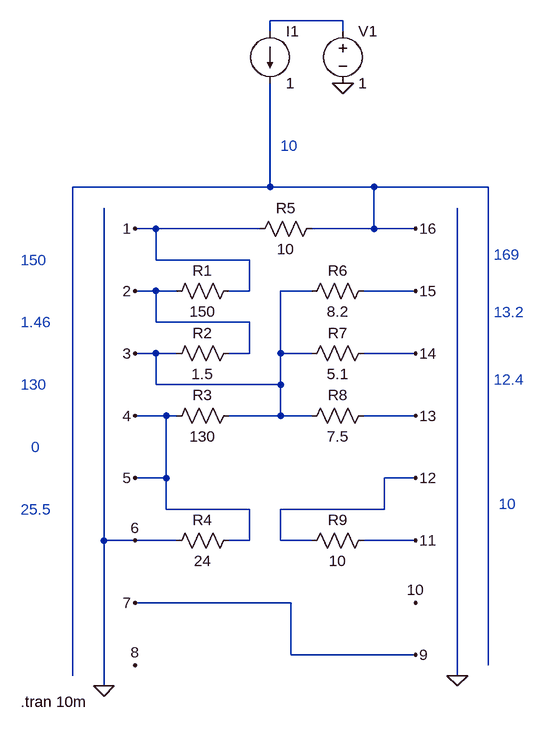
[diagram p0: schematic NetRes 16055376.asc]
NetRes 16055376.asc, the LTspice schematic file:
Version 4
SHEET 1 880 792
WIRE 288 -272 176 -272
WIRE 176 -256 176 -272
WIRE 288 -256 288 -272
WIRE 176 -16 176 -176
WIRE 176 -16 -128 -16
WIRE 336 -16 176 -16
WIRE 512 -16 336 -16
WIRE 0 48 -32 48
WIRE 160 48 0 48
WIRE 336 48 336 -16
WIRE 336 48 240 48
WIRE 400 48 336 48
WIRE 0 96 0 48
WIRE 144 96 0 96
WIRE 0 144 -32 144
WIRE 32 144 0 144
WIRE 144 144 144 96
WIRE 144 144 112 144
WIRE 240 144 192 144
WIRE 400 144 320 144
WIRE 0 192 0 144
WIRE 144 192 0 192
WIRE 0 240 -32 240
WIRE 32 240 0 240
WIRE 144 240 144 192
WIRE 144 240 112 240
WIRE 192 240 192 144
WIRE 240 240 192 240
WIRE 400 240 320 240
WIRE 0 288 0 240
WIRE 192 288 192 240
WIRE 192 288 0 288
WIRE 16 336 -32 336
WIRE 32 336 16 336
WIRE 192 336 192 288
WIRE 192 336 112 336
WIRE 240 336 192 336
WIRE 400 336 320 336
WIRE 16 432 16 336
WIRE 16 432 -32 432
WIRE 400 432 352 432
WIRE 16 480 16 432
WIRE 144 480 16 480
WIRE 352 480 352 432
WIRE 352 480 192 480
WIRE -80 528 -80 16
WIRE -32 528 -80 528
WIRE 32 528 -32 528
WIRE 144 528 144 480
WIRE 144 528 112 528
WIRE 192 528 192 480
WIRE 240 528 192 528
WIRE 400 528 320 528
WIRE 208 624 -32 624
WIRE 208 704 208 624
WIRE 400 704 208 704
WIRE 512 720 512 -16
WIRE -128 736 -128 -16
WIRE 464 736 464 16
WIRE -80 752 -80 528
FLAG -32 48 1
FLAG -32 144 2
FLAG -32 240 3
FLAG -32 336 4
FLAG -32 432 5
FLAG -32 528 6
FLAG 400 48 16
FLAG 400 144 15
FLAG 400 240 14
FLAG 400 336 13
FLAG 400 432 12
FLAG 400 528 11
FLAG 400 624 10
FLAG 400 704 9
FLAG -32 624 7
FLAG -32 720 8
FLAG 288 -176 0
FLAG 464 736 0
FLAG -80 752 0
SYMBOL res 128 128 R90
WINDOW 0 0 56 VBottom 2
WINDOW 3 32 56 VTop 2
SYMATTR InstName R1
SYMATTR Value 150
SYMBOL res 128 224 R90
WINDOW 0 0 56 VBottom 2
WINDOW 3 32 56 VTop 2
SYMATTR InstName R2
SYMATTR Value 1.5
SYMBOL res 128 320 R90
WINDOW 0 0 56 VBottom 2
WINDOW 3 32 56 VTop 2
SYMATTR InstName R3
SYMATTR Value 130
SYMBOL res 128 512 R90
WINDOW 0 0 56 VBottom 2
WINDOW 3 32 56 VTop 2
SYMATTR InstName R4
SYMATTR Value 24
SYMBOL res 256 32 R90
WINDOW 0 0 56 VBottom 2
WINDOW 3 32 56 VTop 2
SYMATTR InstName R5
SYMATTR Value 10
SYMBOL res 336 224 R90
WINDOW 0 0 56 VBottom 2
WINDOW 3 32 56 VTop 2
SYMATTR InstName R7
SYMATTR Value 5.1
SYMBOL res 336 320 R90
WINDOW 0 0 56 VBottom 2
WINDOW 3 32 56 VTop 2
SYMATTR InstName R8
SYMATTR Value 7.5
SYMBOL res 336 512 R90
WINDOW 0 0 56 VBottom 2
WINDOW 3 32 56 VTop 2
SYMATTR InstName R9
SYMATTR Value 10
SYMBOL res 336 128 R90
WINDOW 0 0 56 VBottom 2
WINDOW 3 32 56 VTop 2
SYMATTR InstName R6
SYMATTR Value 8.2
SYMBOL voltage 288 -272 R0
WINDOW 123 0 0 Left 0
WINDOW 39 0 0 Left 0
SYMATTR InstName V1
SYMATTR Value 1
SYMBOL current 176 -256 R0
WINDOW 123 0 0 Left 0
WINDOW 39 0 0 Left 0
SYMATTR InstName I1
SYMATTR Value 1
TEXT -208 96 Left 2 ;150
TEXT -208 192 Left 2 ;1.46
TEXT -208 288 Left 2 ;130
TEXT -192 384 Left 2 ;0
TEXT -208 480 Left 2 ;25.5
TEXT 520 88 Left 2 ;169
TEXT 528 472 Left 2 ;10
TEXT 192 -80 Left 2 ;10
TEXT 520 176 Left 2 ;13.2
TEXT 520 280 Left 2 ;12.4
TEXT -208 776 Left 2 !.tran 10m

The netlist it stands for:
* NetRes 16055376.asc
R1 1 2 150
R2 2 3 1.5
R3 3 5 130
R4 5 0 24
R5 16 1 10
R7 14 3 5.1
R8 13 3 7.5
R9 11 12 10
R6 15 3 8.2
V1 N001 0 1
I1 N001 16 1
* 150
* 1.46
* 130
* 0
* 25.5
* 169
* 10
* 10
* 13.2
* 12.4
.tran 10m
.backanno
.end